# Altium schematic sheet LED_Driver.SchDoc
size A4; SheetNumber: 4; SheetTotal: 5
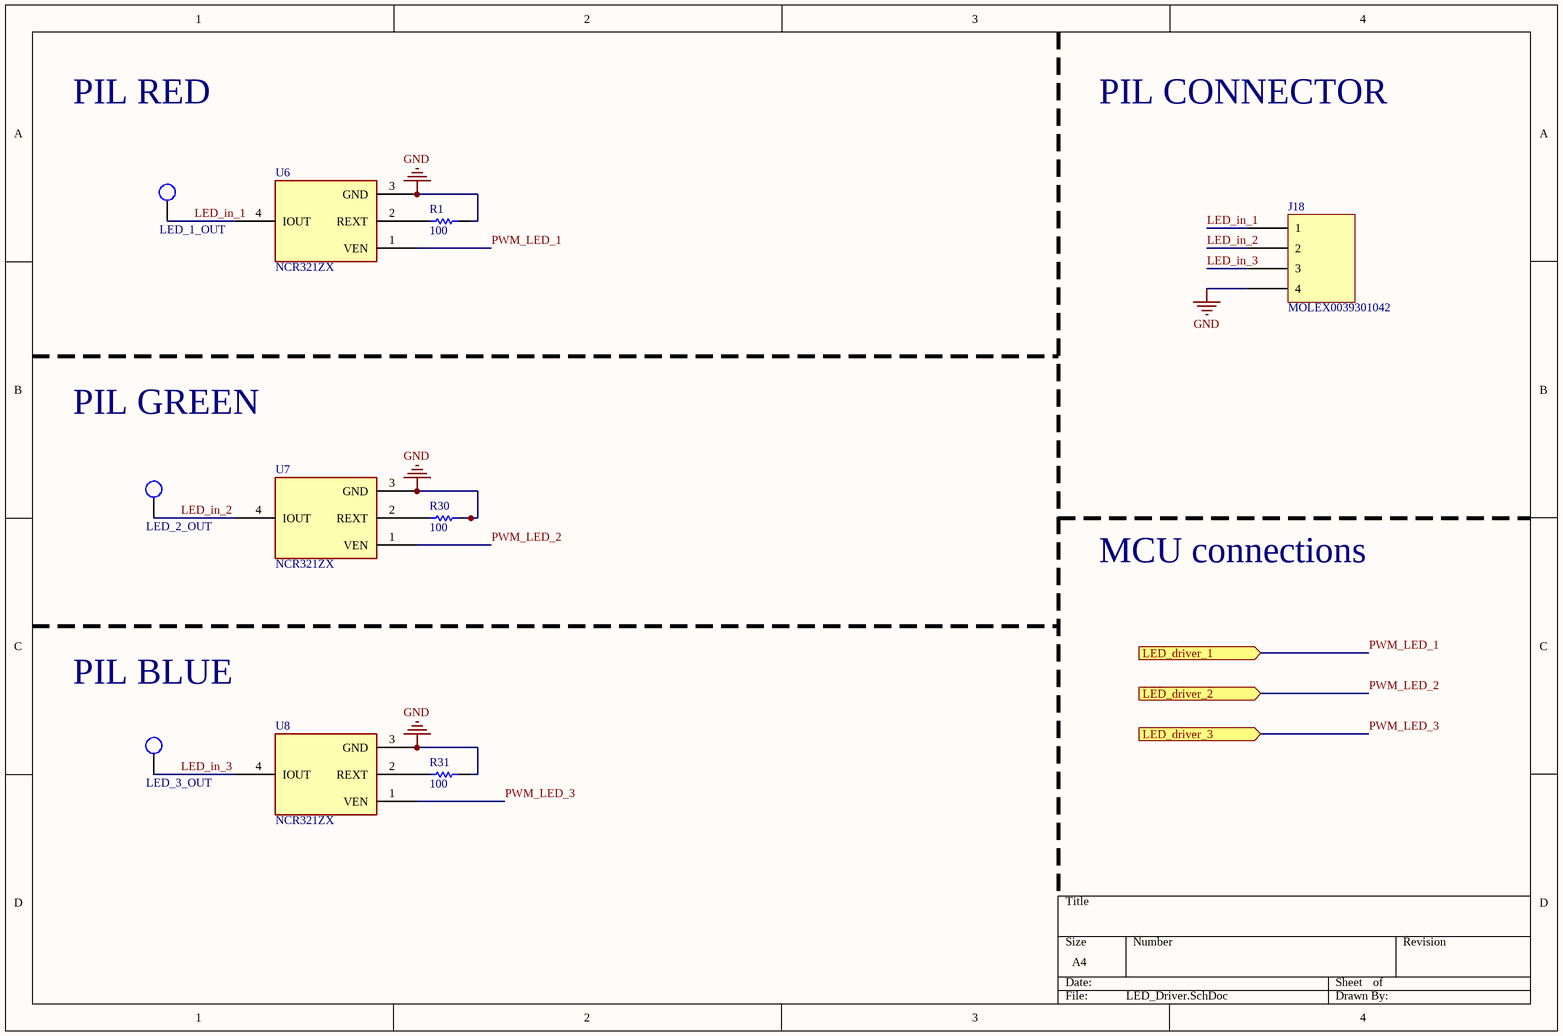
[diagram p0: LED_Driver.SchDoc]

## Parts
J18  MOLEX0039301042  [MOLEX0039301042]
LED_1_OUT  Test Point  [Test Point - 5002]  (value not drawn)  (no BOM)
LED_2_OUT  Test Point  [Test Point - 5002]  (value not drawn)  (no BOM)
LED_3_OUT  Test Point  [Test Point - 5002]  (value not drawn)  (no BOM)
R1  value 100  [0805 - Resistor]  (hidden comment: Resistor)
R30  value 100  [0805 - Resistor]  (hidden comment: Resistor)
R31  value 100  [0805 - Resistor]  (hidden comment: Resistor)
U6  NCR321ZX  [NCR321ZX LED driver]
U7  NCR321ZX  [NCR321ZX LED driver]
U8  NCR321ZX  [NCR321ZX LED driver]

## Ports
LED_driver_1 (in), LED_driver_2 (in), LED_driver_3 (in)

## Nets
GND: J18.4 R1.2 R30.2 R31.2 U6.3(GND) U7.3(GND) U8.3(GND)
LED_in_1: J18.1 LED_1_OUT.1 U6.4(IOUT)
LED_in_2: J18.2 LED_2_OUT.1 U7.4(IOUT)
LED_in_3: J18.3 LED_3_OUT.1 U8.4(IOUT)
PWM_LED_1: U6.1(VEN) ; port LED_driver_1
PWM_LED_2: U7.1(VEN) ; port LED_driver_2
PWM_LED_3: U8.1(VEN) ; port LED_driver_3
NetR1_1: R1.1 U6.2(REXT)
NetR30_1: R30.1 U7.2(REXT)
NetR31_1: R31.1 U8.2(REXT)

## Notes on the sheet
- PIL RED
- PIL CONNECTOR
- PIL GREEN
- MCU connections
- PIL BLUE

## Library data of the parts
J18 = MOLEX0039301042: Connector Header Through Hole, Right Angle 4 position 0.165" (4.20mm); Manufacturer: Molex; Manufacturer Part Number: 0039301042; Supplier: Digikey; Supplier Part Number: WM21364-ND; ComponentLink1Description: Datasheet; ComponentLink1URL: https://www.molex.com/pdm_docs/sd/039301042_sd.pdf
U6-U8 = NCR321ZX: IC LED DRVR LIN PWM 250MA SOT223; Manufacturer name: Nexperia USA Inc.; Supplier 1: Digikey; ComponentLink1Description: Datasheet; ComponentLink1URL: https://assets.nexperia.com/documents/data-sheet/NCR320Z_NCR321Z.pdf; Supplier part number: 1727-8461-2-ND; Manufacturer part number: NCR321ZX
R1 R30 R31 = Resistor: Rating: *; Manufacturer Part Number: *; Manufacturer: *; Supplier Part Number: *; Supplier: *